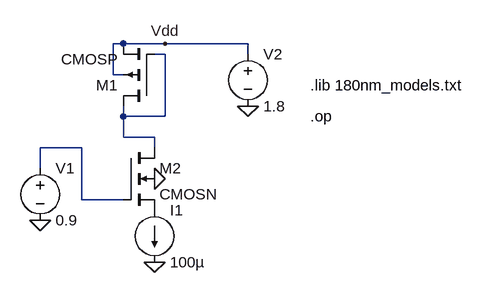
[diagram p0: schematic Ckt1.asc]
Ckt1.asc, the LTspice schematic file:
Version 4
SHEET 1 880 680
WIRE 192 64 176 64
WIRE 256 64 192 64
WIRE 384 64 256 64
WIRE 256 80 240 80
WIRE 384 80 384 64
WIRE 176 112 176 64
WIRE 192 112 176 112
WIRE 192 176 192 160
WIRE 256 176 256 80
WIRE 256 176 192 176
WIRE 192 208 192 176
WIRE 240 208 192 208
WIRE 128 224 64 224
WIRE 240 224 240 208
WIRE 64 256 64 224
WIRE 128 304 128 224
WIRE 192 304 128 304
FLAG 64 336 0
FLAG 384 160 0
FLAG 240 272 0
FLAG 240 400 0
FLAG 256 64 Vdd
SYMBOL pmos4 240 160 R180
SYMATTR InstName M1
SYMATTR Value CMOSP
SYMATTR Value2 l=0.6u w=60u
SYMBOL voltage 64 240 R0
WINDOW 123 0 0 Left 0
WINDOW 39 0 0 Left 0
SYMATTR InstName V1
SYMATTR Value 0.9
SYMBOL voltage 384 64 R0
WINDOW 123 0 0 Left 0
WINDOW 39 0 0 Left 0
SYMATTR InstName V2
SYMATTR Value 1.8
SYMBOL nmos4 192 224 R0
SYMATTR InstName M2
SYMATTR Value CMOSN
SYMATTR Value2 l=5u w=60u
SYMBOL current 240 320 R0
WINDOW 123 0 0 Left 0
WINDOW 39 0 0 Left 0
SYMATTR InstName I1
SYMATTR Value 100µ
TEXT 480 128 Left 2 !.lib 180nm_models.txt
TEXT 480 176 Left 2 !.op

The netlist it stands for:
* Ckt1.asc
M1 N001 N001 Vdd Vdd CMOSP l=0.6u w=60u
V1 N002 0 0.9
V2 Vdd 0 1.8
M2 N001 N002 P001 0 CMOSN l=5u w=60u
I1 P001 0 100µ
.model NMOS NMOS
.model PMOS PMOS
.lib standard.mos
.lib 180nm_models.txt
.op
.backanno
.end